# Altium schematic sheet Can_Bus_Tranciever.SchDoc
size B
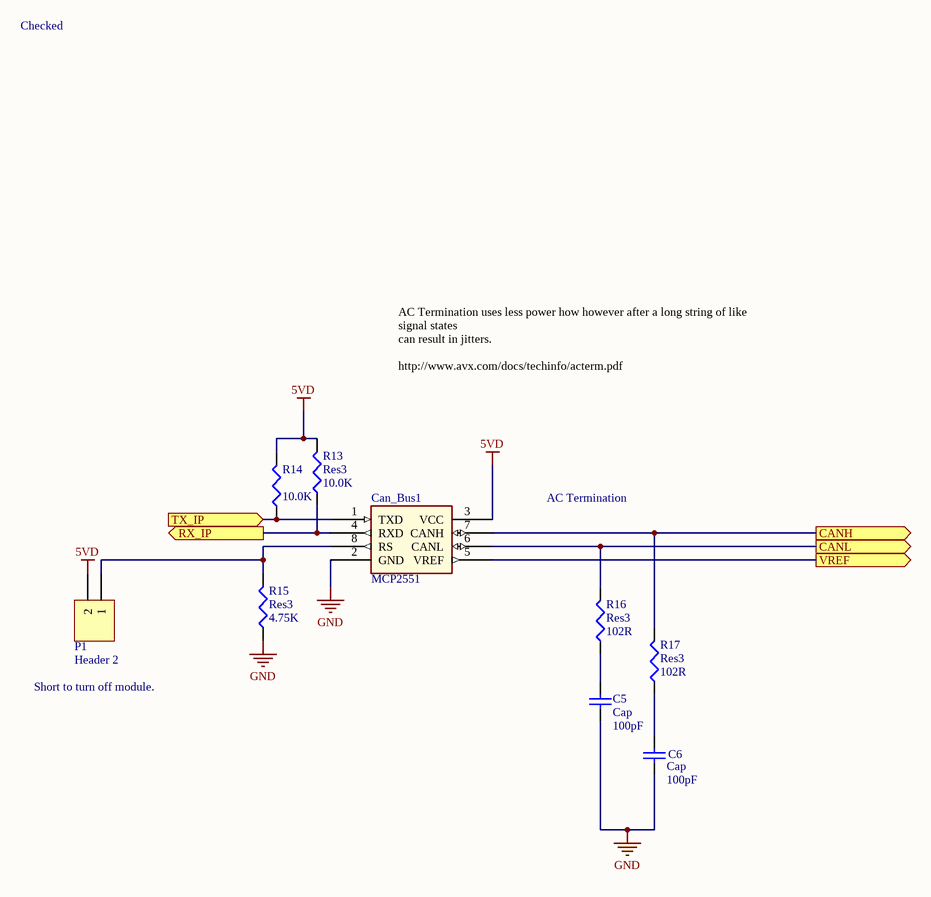
[diagram p0: Can_Bus_Tranciever.SchDoc]

## Parts
C5  Cap  value 100pF  [CAPC2012X09M]
C6  Cap  value 100pF  [CAPC2012X09M]
Can_Bus1  MCP2551  [SOIC127P600X175-8M]
P1  Header 2  [HDR1X2]
R13  Res3  value 10.0K  [RESC2112X05M]
R14  value 10.0K  [RESC2112X05M]  (hidden comment: Res3)
R15  Res3  value 4.75K  [RESC2112X05M]
R16  Res3  value 102R  [RESC2112X05M]
R17  Res3  value 102R  [RESC2112X05M]

## Ports
CANH (out), CANL (out), RX_IP (out), TX_IP (in), VREF (out)

## Nets
5VD: Can_Bus1.3(VCC) P1.2 R13.2 R14.2
GND: C5.1 C6.1 Can_Bus1.2(GND) R15.1
CANH: Can_Bus1.7(CANH) R17.2 ; port CANH
CANL: Can_Bus1.6(CANL) R16.2 ; port CANL
RX_IP: Can_Bus1.4(RXD) R13.1 ; port RX_IP
TX_IP: Can_Bus1.1(TXD) R14.1 ; port TX_IP
VREF: Can_Bus1.5(VREF) ; port VREF
NetC5_2: C5.2 R16.1
NetC6_2: C6.2 R17.1
NetCan_Bus1_8: Can_Bus1.8(RS) P1.1 R15.2

## Notes on the sheet
- Checked
- AC Termination uses less power how however after a long string of like signal states
  can result in jitters.
  http://www.avx.com/docs/techinfo/acterm.pdf
- AC Termination
- Short to turn off module.
- ESE
- is the sole property of ESE. Any reproduction
- The Information Contained in this drawing
- Schematic P/N and Name
- Sheet Name
- 299 Doon Valley Drive
- Kitchener, ON N2G 4M4
- Canada
- Approved
- in part or in whole without the written
- permission of ESE is strictly prohibited.
- APPROVALS
- DATE
- Size
- Scale
- B
- NTS
- Bare PCB P/N
- Date
- Sheet
- Rev.
- Engineer
- of

## Library data of the parts
C5 C6 = CAP-COG-100pF-500V-±5%: CAP CER 100pF 500v COG 0805; MPN: C0805C101JCGACTU; PN: 399-5102-1-ND; Name: CAP-COG-100pF-500V-±5%; URL: http://www.digikey.ca/product-detail/en/C0805C101JCGACTU/399-5102-1-ND
Can_Bus1 = MCP2551: IC TRANSCEIVER CAN HI-SPD 8-SOIC; MPN: MCP2551T-E/SN; PN: MCP2551T-E/SNCT-ND; URL: http://ww1.microchip.com/downloads/en/DeviceDoc/21667f.pdf
P1 = Header 2: Header, 2-Pin Male; MPN: PEC02SFAN; PN: S1212E-02-ND; URL: http://www.digikey.ca/product-detail/en/PEC04SFAN/S1212E-02-ND
R13 R14 = Resistor_10.0K: RES SMD 10.0K OHM 1% 1/8W 0805; MPN: CRCW080510K0FKEA; PN: 541-10.0KCCT-ND; Name: Resistor_10.0K; URL: http://www.digikey.ca/product-detail/en/CRCW080510K0FKEA/541-10.0KCCT-ND
R15 = Resistor_4.75K: RES SMD 4.75K OHM 1% 1/8W 0805; MPN: CRCW08054K75FKEA; PN: 541-4.75KCCT-ND; Name: Resistor_4.75K; URL: http://www.digikey.ca/product-detail/en/CRCW08054K75FKEA/541-4.75KCCT-ND
R16 R17 = Resistor_102R: RES SMD 102R OHM 1% 1/8W 0805; MPN: CRCW0805102RFKEA; PN: 541-102CCT-ND; Name: Resistor_102R; URL: http://www.digikey.ca/product-detail/en/CRCW0805102RFKEA/541-102CCT-ND